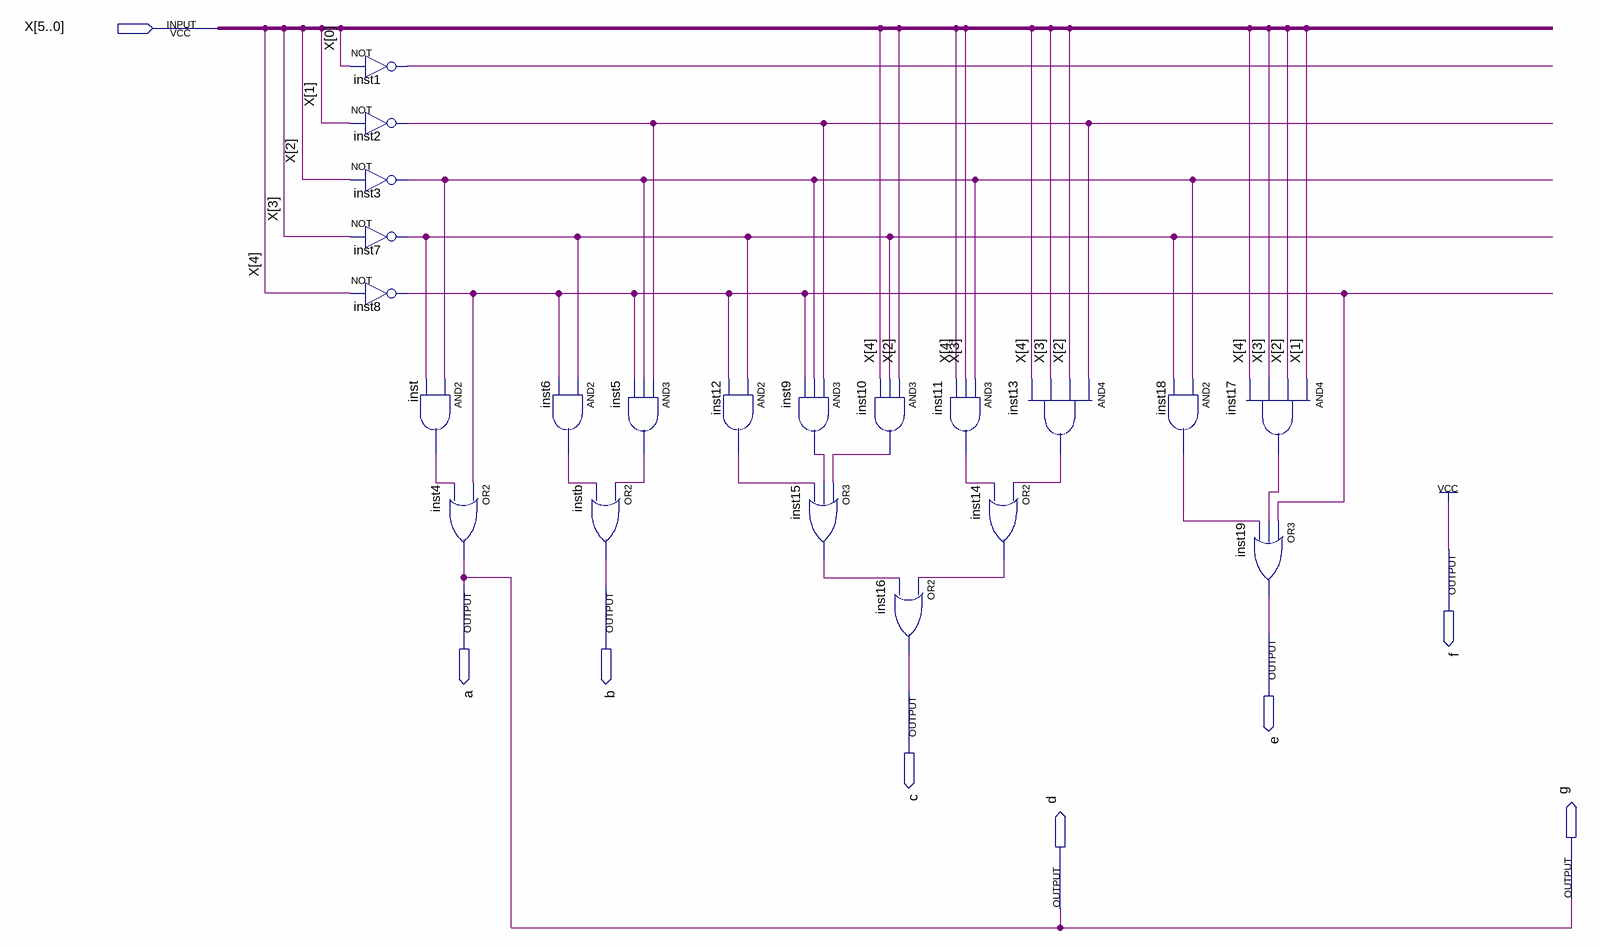
[diagram p0: schematic sheet]
// Quartus schematic BCDdezenas.bdf as structural Verilog: 21 symbols, 8 pins
module BCDdezenas (
  input  [5:0] X,
  output f,
  output a,
  output b,
  output e,
  output c,
  output g,
  output d
);

  wire inst1_out, inst2_out, inst3_out, inst5_out, inst6_out, inst7_out, inst8_out, inst9_out, inst10_out,
       inst11_out, inst12_out, inst13_out, inst14_out, inst15_out, inst17_out, inst18_out, inst_out;

  not inst1 (inst1_out, X[0]);
  not inst2 (inst2_out, X[1]);
  not inst3 (inst3_out, X[2]);
  not inst7 (inst7_out, X[3]);
  not inst8 (inst8_out, X[4]);
  and inst (inst_out, inst3_out, inst7_out);
  or inst4 (a, inst8_out, inst_out);
  and inst6 (inst6_out, inst7_out, inst8_out);
  or instb (b, inst5_out, inst6_out);
  and inst5 (inst5_out, inst2_out, inst3_out, inst8_out);
  and inst12 (inst12_out, inst7_out, inst8_out);
  and inst9 (inst9_out, inst2_out, inst3_out, inst8_out);
  or inst15 (inst15_out, inst10_out, inst9_out, inst12_out);
  and inst10 (inst10_out, X[2], inst7_out, X[4]);
  or inst16 (c, inst14_out, inst15_out);
  and inst11 (inst11_out, inst3_out, X[3], X[4]);
  and inst13 (inst13_out, inst2_out, X[2], X[3], X[4]);
  or inst14 (inst14_out, inst13_out, inst11_out);
  and inst18 (inst18_out, inst3_out, inst7_out);
  and inst17 (inst17_out, X[1], X[2], X[3], X[4]);
  or inst19 (e, inst8_out, inst17_out, inst18_out);

  assign d = a;
  assign f = 1'b1;
  assign g = a;
endmodule
